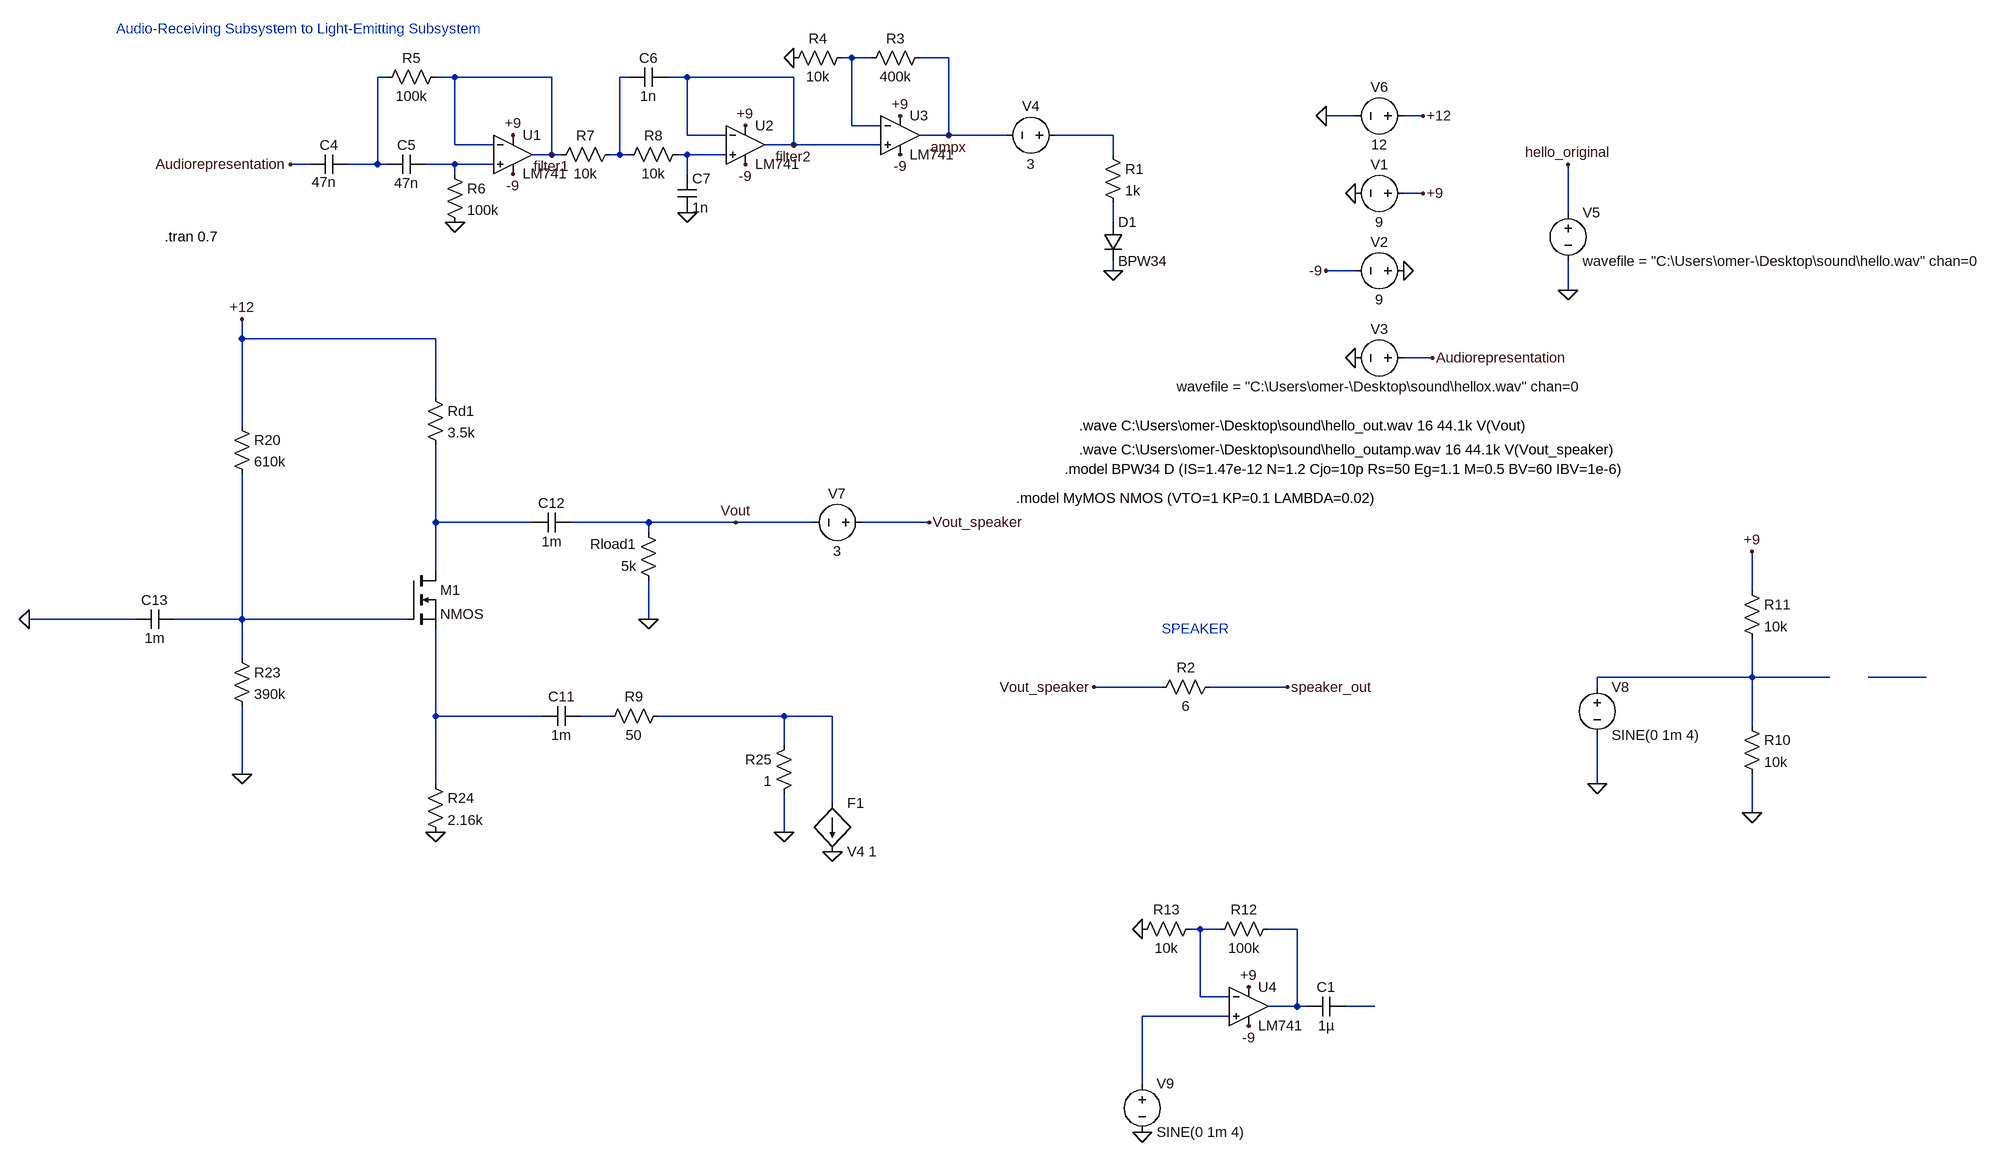
[diagram p0: schematic project_sound_success_1.1.asc]
project_sound_success_1.1.asc, the LTspice schematic file:
Version 4
SHEET 1 1992 1640
WIRE 32 -432 16 -432
WIRE 64 -432 32 -432
WIRE 192 -432 144 -432
WIRE -736 -400 -752 -400
WIRE -624 -400 -656 -400
WIRE -464 -400 -624 -400
WIRE -336 -400 -352 -400
WIRE -240 -400 -272 -400
WIRE -64 -400 -240 -400
WIRE 864 -336 816 -336
WIRE 976 -336 944 -336
WIRE 32 -320 32 -432
WIRE 80 -320 32 -320
WIRE -240 -304 -240 -400
WIRE -176 -304 -240 -304
WIRE 192 -304 192 -432
WIRE 192 -304 144 -304
WIRE 288 -304 192 -304
WIRE 464 -304 368 -304
WIRE -624 -288 -624 -400
WIRE -560 -288 -624 -288
WIRE -64 -288 -64 -400
WIRE -64 -288 -112 -288
WIRE 80 -288 -64 -288
WIRE -464 -272 -464 -400
WIRE -464 -272 -496 -272
WIRE -448 -272 -464 -272
WIRE -352 -272 -352 -400
WIRE -352 -272 -368 -272
WIRE -336 -272 -352 -272
WIRE -240 -272 -256 -272
WIRE -176 -272 -240 -272
WIRE 464 -272 464 -304
WIRE -864 -256 -896 -256
WIRE -752 -256 -752 -400
WIRE -752 -256 -800 -256
WIRE -736 -256 -752 -256
WIRE -624 -256 -672 -256
WIRE -560 -256 -624 -256
WIRE -624 -240 -624 -256
WIRE -240 -240 -240 -272
WIRE 976 -208 944 -208
WIRE 1216 -176 1216 -256
WIRE 464 -160 464 -192
WIRE 464 -80 464 -96
WIRE 864 -80 816 -80
WIRE 1216 -48 1216 -96
WIRE -976 32 -976 0
WIRE -656 32 -976 32
WIRE 992 64 944 64
WIRE -656 128 -656 32
WIRE -976 176 -976 32
WIRE -656 336 -656 208
WIRE -496 336 -656 336
WIRE -304 336 -432 336
WIRE -160 336 -304 336
WIRE -32 336 -160 336
WIRE 160 336 48 336
WIRE -304 352 -304 336
WIRE -656 416 -656 336
WIRE 1520 448 1520 384
WIRE -1152 496 -1328 496
WIRE -976 496 -976 256
WIRE -976 496 -1088 496
WIRE -704 496 -976 496
WIRE -304 496 -304 432
WIRE -976 560 -976 496
WIRE 1520 592 1520 528
WIRE 1520 592 1264 592
WIRE 1648 592 1520 592
WIRE 1808 592 1712 592
WIRE 544 608 432 608
WIRE 752 608 624 608
WIRE 1264 608 1264 592
WIRE -656 656 -656 512
WIRE -480 656 -656 656
WIRE -368 656 -416 656
WIRE -80 656 -288 656
WIRE 0 656 -80 656
WIRE 1520 672 1520 592
WIRE -80 704 -80 656
WIRE -976 752 -976 640
WIRE -656 768 -656 656
WIRE 1264 768 1264 688
WIRE 0 800 0 656
WIRE 1520 816 1520 752
WIRE -80 848 -80 784
WIRE 608 1008 592 1008
WIRE 640 1008 608 1008
WIRE 768 1008 720 1008
WIRE 608 1120 608 1008
WIRE 656 1120 608 1120
WIRE 768 1136 768 1008
WIRE 768 1136 720 1136
WIRE 784 1136 768 1136
WIRE 896 1136 848 1136
WIRE 656 1152 512 1152
WIRE 512 1264 512 1152
FLAG 112 -336 +9
FLAG 112 -272 -9
FLAG -64 -432 0
FLAG -624 -160 0
FLAG -528 -304 +9
FLAG -144 -320 +9
FLAG -144 -256 -9
FLAG -528 -240 -9
FLAG -240 -176 0
FLAG -896 -256 Audiorepresentation
FLAG 864 -208 0
FLAG 944 -80 0
FLAG 864 64 0
FLAG 976 -208 +9
FLAG 816 -80 -9
FLAG 992 64 Audiorepresentation
FLAG -464 -272 filter1
FLAG -64 -288 filter2
FLAG 816 -336 0
FLAG 976 -336 +12
FLAG 192 -304 ampx
FLAG 1216 -48 0
FLAG 1216 -256 hello_original
FLAG -304 496 0
FLAG -976 752 0
FLAG -656 848 0
FLAG -1328 496 0
FLAG -160 336 Vout
FLAG -976 0 +12
FLAG 0 880 0
FLAG -80 848 0
FLAG 160 336 Vout_speaker
FLAG 752 608 speaker_out
FLAG 432 608 Vout_speaker
FLAG 464 -80 0
FLAG 1520 816 0
FLAG 1264 768 0
FLAG 1520 384 +9
FLAG 688 1104 +9
FLAG 688 1168 -9
FLAG 512 1008 0
FLAG 512 1344 0
SYMBOL res 160 -448 R90
WINDOW 0 0 56 VBottom 2
WINDOW 3 32 56 VTop 2
SYMATTR InstName R3
SYMATTR Value 400k
SYMBOL res -80 -416 R270
WINDOW 0 32 56 VTop 2
WINDOW 3 0 56 VBottom 2
SYMATTR InstName R4
SYMATTR Value 10k
SYMBOL cap -800 -240 M270
WINDOW 0 32 32 VTop 2
WINDOW 3 -14 61 VLeft 2
SYMATTR InstName C4
SYMATTR Value 47n
SYMBOL cap -672 -272 R90
WINDOW 0 0 32 VBottom 2
WINDOW 3 32 32 VTop 2
SYMATTR InstName C5
SYMATTR Value 47n
SYMBOL res -640 -416 R90
WINDOW 0 0 56 VBottom 2
WINDOW 3 32 56 VTop 2
SYMATTR InstName R5
SYMATTR Value 100k
SYMBOL res -640 -256 R0
SYMATTR InstName R6
SYMATTR Value 100k
SYMBOL res -352 -288 R90
WINDOW 0 0 56 VBottom 2
WINDOW 3 32 56 VTop 2
SYMATTR InstName R7
SYMATTR Value 10k
SYMBOL cap -272 -416 R90
WINDOW 0 0 32 VBottom 2
WINDOW 3 32 32 VTop 2
SYMATTR InstName C6
SYMATTR Value 1n
SYMBOL cap -256 -240 R0
SYMATTR InstName C7
SYMATTR Value 1n
SYMBOL res -240 -288 R90
WINDOW 0 0 56 VBottom 2
WINDOW 3 32 56 VTop 2
SYMATTR InstName R8
SYMATTR Value 10k
SYMBOL voltage 960 -208 R90
WINDOW 0 -32 56 VBottom 2
WINDOW 3 32 56 VTop 2
WINDOW 123 0 0 Left 0
WINDOW 39 0 0 Left 0
SYMATTR InstName V1
SYMATTR Value 9
SYMBOL voltage 960 -80 R90
WINDOW 0 -32 56 VBottom 2
WINDOW 3 32 56 VTop 2
WINDOW 123 0 0 Left 0
WINDOW 39 0 0 Left 0
SYMATTR InstName V2
SYMATTR Value 9
SYMBOL voltage 960 64 R90
WINDOW 0 -32 56 VBottom 2
WINDOW 3 32 56 VTop 2
WINDOW 123 0 0 Left 0
WINDOW 39 0 0 Left 0
SYMATTR InstName V3
SYMATTR Value wavefile = "C:\Users\omer-\Desktop\sound\hellox.wav" chan=0
SYMBOL voltage 960 -336 R90
WINDOW 0 -32 56 VBottom 2
WINDOW 3 32 56 VTop 2
WINDOW 123 0 0 Left 0
WINDOW 39 0 0 Left 0
SYMATTR InstName V6
SYMATTR Value 12
SYMBOL voltage 1216 -192 R0
SYMATTR InstName V5
SYMATTR Value wavefile = "C:\Users\omer-\Desktop\sound\hello.wav" chan=0
SYMBOL OpAmps\\LM741 -528 -336 R0
SYMATTR InstName U1
SYMBOL OpAmps\\LM741 -144 -352 R0
SYMATTR InstName U2
SYMBOL OpAmps\\LM741 112 -368 R0
SYMATTR InstName U3
SYMBOL res -992 160 R0
SYMATTR InstName R20
SYMATTR Value 610k
SYMBOL res -992 544 R0
SYMATTR InstName R23
SYMATTR Value 390k
SYMBOL res -672 112 R0
SYMATTR InstName Rd1
SYMATTR Value 3.5k
SYMBOL res -672 752 R0
SYMATTR InstName R24
SYMATTR Value 2.16k
SYMBOL res -288 448 R180
WINDOW 0 36 76 Left 2
WINDOW 3 36 40 Left 2
SYMATTR InstName Rload1
SYMATTR Value 5k
SYMBOL cap -416 640 R90
WINDOW 0 0 32 VBottom 2
WINDOW 3 32 32 VTop 2
SYMATTR InstName C11
SYMATTR Value 1m
SYMBOL cap -432 320 R90
WINDOW 0 0 32 VBottom 2
WINDOW 3 32 32 VTop 2
SYMATTR InstName C12
SYMATTR Value 1m
SYMBOL cap -1088 480 R90
WINDOW 0 0 32 VBottom 2
WINDOW 3 32 32 VTop 2
SYMATTR InstName C13
SYMATTR Value 1m
SYMBOL res -64 688 M0
SYMATTR InstName R25
SYMATTR Value 1
SYMBOL voltage 64 336 R90
WINDOW 0 -32 56 VBottom 2
WINDOW 3 32 56 VTop 2
WINDOW 123 0 0 Left 0
WINDOW 39 0 0 Left 0
SYMATTR InstName V7
SYMATTR Value 3
SYMBOL res 640 592 R90
WINDOW 0 0 56 VBottom 2
WINDOW 3 32 56 VTop 2
SYMATTR InstName R2
SYMATTR Value 6
SYMBOL nmos -704 416 R0
SYMATTR InstName M1
SYMBOL voltage 384 -304 R90
WINDOW 0 -32 56 VBottom 2
WINDOW 3 32 56 VTop 2
WINDOW 123 0 0 Left 0
WINDOW 39 0 0 Left 0
SYMATTR InstName V4
SYMATTR Value 3
SYMBOL res 448 -288 R0
SYMATTR InstName R1
SYMATTR Value 1k
SYMBOL diode 448 -160 R0
SYMATTR InstName D1
SYMATTR Value BPW34
SYMBOL f 0 800 R0
SYMATTR InstName F1
SYMATTR Value V4 1
SYMBOL res -272 640 R90
WINDOW 0 0 56 VBottom 2
WINDOW 3 32 56 VTop 2
SYMATTR InstName R9
SYMATTR Value 50
SYMBOL voltage 1264 592 R0
WINDOW 123 0 0 Left 0
WINDOW 39 0 0 Left 0
SYMATTR InstName V8
SYMATTR Value SINE(0 1m 4)
SYMBOL res 1504 656 R0
SYMATTR InstName R10
SYMATTR Value 10k
SYMBOL res 1504 432 R0
SYMATTR InstName R11
SYMATTR Value 10k
SYMBOL res 736 992 R90
WINDOW 0 0 56 VBottom 2
WINDOW 3 32 56 VTop 2
SYMATTR InstName R12
SYMATTR Value 100k
SYMBOL res 496 1024 R270
WINDOW 0 32 56 VTop 2
WINDOW 3 0 56 VBottom 2
SYMATTR InstName R13
SYMATTR Value 10k
SYMBOL OpAmps\\LM741 688 1072 R0
SYMATTR InstName U4
SYMBOL voltage 512 1248 R0
WINDOW 123 0 0 Left 0
WINDOW 39 0 0 Left 0
SYMATTR InstName V9
SYMATTR Value SINE(0 1m 4)
SYMBOL cap 848 1120 R90
WINDOW 0 0 32 VBottom 2
WINDOW 3 32 32 VTop 2
SYMATTR InstName C1
SYMATTR Value 1µ
TEXT -1104 -136 Left 2 !.tran 0.7
TEXT -1184 -480 Left 2 ;Audio-Receiving Subsystem to Light-Emitting Subsystem
TEXT 408 176 Left 2 !.wave C:\\Users\\omer-\\Desktop\\sound\\hello_out.wav 16 44.1k V(Vout)
TEXT 408 216 Left 2 !.wave C:\\Users\\omer-\\Desktop\\sound\\hello_outamp.wav 16 44.1k V(Vout_speaker)
TEXT 304 296 Left 2 !.model MyMOS NMOS (VTO=1 KP=0.1 LAMBDA=0.02)
TEXT 544 512 Left 2 ;SPEAKER
TEXT 384 248 Left 2 !.model BPW34 D (IS=1.47e-12 N=1.2 Cjo=10p Rs=50 Eg=1.1 M=0.5 BV=60 IBV=1e-6)

The netlist it stands for:
* project_sound_success_1.1.asc
R3 ampx N001 400k
R4 0 N001 10k
C4 N002 Audiorepresentation 47n
C5 N006 N002 47n
R5 filter1 N002 100k
R6 N006 0 100k
R7 N003 filter1 10k
C6 filter2 N003 1n
C7 N005 0 1n
R8 N005 N003 10k
V1 +9 0 9
V2 0 -9 9
V3 Audiorepresentation 0 wavefile = "C:\Users\omer-\Desktop\sound\hellox.wav" chan=0
V6 +12 0 12
V5 hello_original 0 wavefile = "C:\Users\omer-\Desktop\sound\hello.wav" chan=0
XU1 N006 filter1 +9 -9 filter1 LM741  ; pins In+ In- V+ V- OUT
XU2 N005 filter2 +9 -9 filter2 LM741  ; pins In+ In- V+ V- OUT
XU3 filter2 N001 +9 -9 ampx LM741  ; pins In+ In- V+ V- OUT
R20 +12 N009 610k
R23 N009 0 390k
Rd1 +12 N008 3.5k
R24 N012 0 2.16k
Rload1 0 Vout 5k
C11 N013 N012 1m
C12 Vout N008 1m
C13 N009 0 1m
R25 N014 0 1
V7 Vout_speaker Vout 3
R2 speaker_out Vout_speaker 6
M1 N008 N009 N012 N012 NMOS
V4 N004 ampx 3
R1 N004 N007 1k
D1 N007 0 BPW34
F1 N014 0 V4 1
R9 N014 N013 50
V8 N010 0 SINE(0 1m 4)
R10 N010 0 10k
R11 +9 N010 10k
R12 N016 N015 100k
R13 0 N015 10k
XU4 N018 N015 +9 -9 N016 LM741  ; pins In+ In- V+ V- OUT
V9 N018 0 SINE(0 1m 4)
C1 N017 N016 1µ
.model D D
.lib standard.dio
.model NMOS NMOS
.model PMOS PMOS
.lib standard.mos
.tran 0.7
* Audio-Receiving Subsystem to Light-Emitting Subsystem
.wave C:\Users\omer-\Desktop\sound\hello_out.wav 16 44.1k V(Vout)
.wave C:\Users\omer-\Desktop\sound\hello_outamp.wav 16 44.1k V(Vout_speaker)
.model MyMOS NMOS (VTO=1 KP=0.1 LAMBDA=0.02)
* SPEAKER
.model BPW34 D (IS=1.47e-12 N=1.2 Cjo=10p Rs=50 Eg=1.1 M=0.5 BV=60 IBV=1e-6)
.lib LM741.lib
.backanno
.end